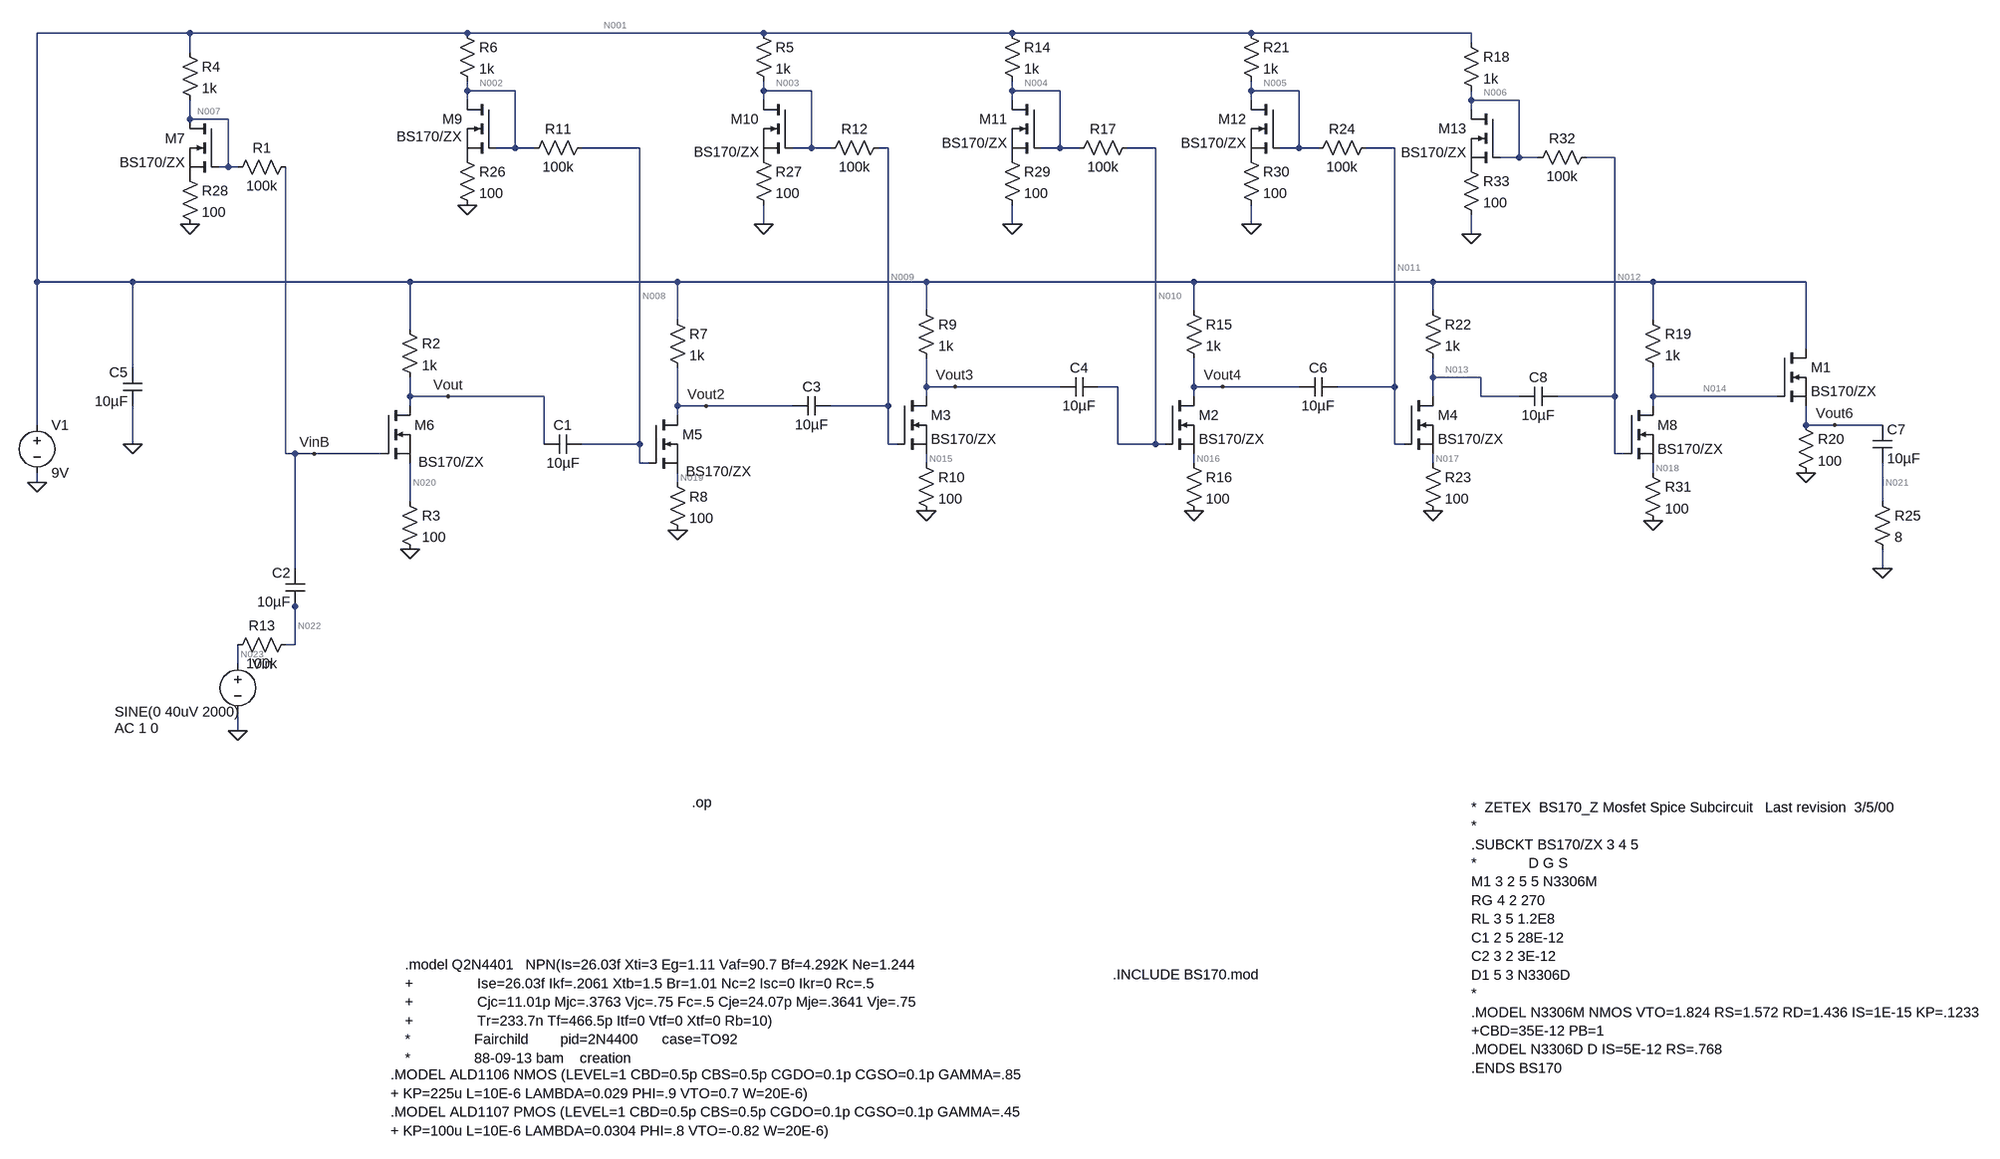
[diagram p0: schematic Design1v2.asc]
Design1v2.asc, the LTspice schematic file:
Version 4
SHEET 1 2836 1636
WIRE -144 -192 -400 -192
WIRE 320 -192 -144 -192
WIRE 816 -192 320 -192
WIRE 1232 -192 816 -192
WIRE 1632 -192 1232 -192
WIRE 2000 -192 1632 -192
WIRE 2000 -176 2000 -192
WIRE -144 -160 -144 -192
WIRE 320 -96 320 -112
WIRE 400 -96 320 -96
WIRE 816 -96 816 -112
WIRE 896 -96 816 -96
WIRE 1232 -96 1232 -112
WIRE 1312 -96 1232 -96
WIRE 1632 -96 1632 -112
WIRE 1712 -96 1632 -96
WIRE 320 -80 320 -96
WIRE 816 -80 816 -96
WIRE 1232 -80 1232 -96
WIRE 1632 -80 1632 -96
WIRE 2000 -80 2000 -96
WIRE 2080 -80 2000 -80
WIRE 2000 -64 2000 -80
WIRE -144 -48 -144 -80
WIRE -80 -48 -144 -48
WIRE 400 0 400 -96
WIRE 400 0 368 0
WIRE 432 0 400 0
WIRE 608 0 512 0
WIRE 896 0 896 -96
WIRE 896 0 864 0
WIRE 928 0 896 0
WIRE 1024 0 1008 0
WIRE 1312 0 1312 -96
WIRE 1312 0 1280 0
WIRE 1344 0 1312 0
WIRE 1472 0 1424 0
WIRE 1712 0 1712 -96
WIRE 1712 0 1680 0
WIRE 1744 0 1712 0
WIRE 1872 0 1824 0
WIRE 2080 16 2080 -80
WIRE 2080 16 2048 16
WIRE 2112 16 2080 16
WIRE 2240 16 2192 16
WIRE -80 32 -80 -48
WIRE -80 32 -96 32
WIRE -64 32 -80 32
WIRE 816 128 816 96
WIRE 1232 128 1232 96
WIRE 1632 128 1632 96
WIRE 2000 144 2000 112
WIRE -400 224 -400 -192
WIRE -240 224 -400 224
WIRE 224 224 -240 224
WIRE 672 224 224 224
WIRE 1088 224 672 224
WIRE 1536 224 1088 224
WIRE 1936 224 1536 224
WIRE 2304 224 1936 224
WIRE 2560 224 2304 224
WIRE 1088 272 1088 224
WIRE 1536 272 1536 224
WIRE 1936 272 1936 224
WIRE 672 288 672 224
WIRE 2304 288 2304 224
WIRE 224 304 224 224
WIRE 2560 336 2560 224
WIRE -240 368 -240 224
WIRE 1936 384 1936 352
WIRE 2016 384 1936 384
WIRE 1088 400 1088 352
WIRE 1136 400 1088 400
WIRE 1312 400 1136 400
WIRE 1408 400 1376 400
WIRE 1536 400 1536 352
WIRE 1584 400 1536 400
WIRE 1712 400 1584 400
WIRE 1872 400 1872 0
WIRE 1872 400 1776 400
WIRE 224 416 224 384
WIRE 288 416 224 416
WIRE 448 416 288 416
WIRE 1088 416 1088 400
WIRE 1536 416 1536 400
WIRE 1936 416 1936 384
WIRE 2016 416 2016 384
WIRE 2080 416 2016 416
WIRE 2240 416 2240 16
WIRE 2240 416 2144 416
WIRE 2304 416 2304 368
WIRE 2512 416 2304 416
WIRE 224 432 224 416
WIRE 672 432 672 368
WIRE 720 432 672 432
WIRE 864 432 720 432
WIRE 1024 432 1024 0
WIRE 1024 432 928 432
WIRE 2304 432 2304 416
WIRE 672 448 672 432
WIRE -400 464 -400 224
WIRE 2560 464 2560 432
WIRE 2608 464 2560 464
WIRE 2688 464 2608 464
WIRE -240 496 -240 432
WIRE 448 496 448 416
WIRE 608 496 608 0
WIRE 608 496 512 496
WIRE 1024 496 1024 432
WIRE 1040 496 1024 496
WIRE 1408 496 1408 400
WIRE 1472 496 1472 0
WIRE 1472 496 1408 496
WIRE 1488 496 1472 496
WIRE 1872 496 1872 400
WIRE 1888 496 1872 496
WIRE 16 512 16 32
WIRE 32 512 16 512
WIRE 64 512 32 512
WIRE 176 512 64 512
WIRE 2240 512 2240 416
WIRE 2256 512 2240 512
WIRE 608 528 608 496
WIRE 624 528 608 528
WIRE 1088 528 1088 512
WIRE 1536 528 1536 512
WIRE 1936 528 1936 512
WIRE 2304 544 2304 528
WIRE -400 560 -400 544
WIRE 672 560 672 544
WIRE 224 592 224 528
WIRE 2688 592 2688 528
WIRE 32 704 32 512
WIRE 2688 704 2688 672
WIRE 32 768 32 752
WIRE 32 832 32 768
WIRE 32 832 16 832
WIRE -64 864 -64 832
WIRE -64 976 -64 944
FLAG -400 560 0
FLAG 224 672 0
FLAG 320 96 0
FLAG 672 640 0
FLAG 288 416 Vout
FLAG -64 976 0
FLAG 64 512 VinB
FLAG 720 432 Vout2
FLAG 816 128 0
FLAG 1088 608 0
FLAG 1136 400 Vout3
FLAG 1232 128 0
FLAG 1536 608 0
FLAG 1584 400 Vout4
FLAG 2608 464 Vout6
FLAG 1632 128 0
FLAG 1936 608 0
FLAG 2560 544 0
FLAG -144 128 0
FLAG 2688 704 0
FLAG -240 496 0
FLAG 2000 144 0
FLAG 2304 624 0
SYMBOL cap 48 768 R180
WINDOW 0 24 56 Left 2
WINDOW 3 24 8 Left 2
SYMATTR InstName C2
SYMATTR Value 10µF
SYMBOL voltage -400 448 R0
SYMATTR InstName V1
SYMATTR Value 9V
SYMBOL voltage -64 848 R0
WINDOW 3 -206 96 Left 2
WINDOW 123 -206 124 Left 2
WINDOW 39 0 0 Left 2
SYMATTR Value SINE(0 40uV 2000)
SYMATTR Value2 AC 1 0
SYMATTR InstName Vin
SYMBOL res 208 576 R0
SYMATTR InstName R3
SYMATTR Value 100
SYMBOL res -160 -176 R0
SYMATTR InstName R4
SYMATTR Value 1k
SYMBOL res 208 288 R0
SYMATTR InstName R2
SYMATTR Value 1k
SYMBOL res 304 -208 R0
SYMATTR InstName R6
SYMATTR Value 1k
SYMBOL res 656 272 R0
SYMATTR InstName R7
SYMATTR Value 1k
SYMBOL res 656 544 R0
SYMATTR InstName R8
SYMATTR Value 100
SYMBOL res 528 -16 R90
WINDOW 0 0 56 VBottom 2
WINDOW 3 32 56 VTop 2
SYMATTR InstName R11
SYMATTR Value 100k
SYMBOL cap 512 480 R90
WINDOW 0 0 32 VBottom 2
WINDOW 3 32 32 VTop 2
SYMATTR InstName C1
SYMATTR Value 10µF
SYMBOL res 800 -208 R0
SYMATTR InstName R5
SYMATTR Value 1k
SYMBOL res 1072 256 R0
SYMATTR InstName R9
SYMATTR Value 1k
SYMBOL res 1072 512 R0
SYMATTR InstName R10
SYMATTR Value 100
SYMBOL res 1024 -16 R90
WINDOW 0 0 56 VBottom 2
WINDOW 3 32 56 VTop 2
SYMATTR InstName R12
SYMATTR Value 100k
SYMBOL cap 928 416 R90
WINDOW 0 0 32 VBottom 2
WINDOW 3 32 32 VTop 2
SYMATTR InstName C3
SYMATTR Value 10µF
SYMBOL res 1216 -208 R0
SYMATTR InstName R14
SYMATTR Value 1k
SYMBOL res 1520 256 R0
SYMATTR InstName R15
SYMATTR Value 1k
SYMBOL res 1520 512 R0
SYMATTR InstName R16
SYMATTR Value 100
SYMBOL res 1440 -16 R90
WINDOW 0 0 56 VBottom 2
WINDOW 3 32 56 VTop 2
SYMATTR InstName R17
SYMATTR Value 100k
SYMBOL cap 1376 384 R90
WINDOW 0 0 32 VBottom 2
WINDOW 3 32 32 VTop 2
SYMATTR InstName C4
SYMATTR Value 10µF
SYMBOL res 1616 -208 R0
SYMATTR InstName R21
SYMATTR Value 1k
SYMBOL res 1920 256 R0
SYMATTR InstName R22
SYMATTR Value 1k
SYMBOL res 1920 512 R0
SYMATTR InstName R23
SYMATTR Value 100
SYMBOL res 1840 -16 R90
WINDOW 0 0 56 VBottom 2
WINDOW 3 32 56 VTop 2
SYMATTR InstName R24
SYMATTR Value 100k
SYMBOL cap 1776 384 R90
WINDOW 0 0 32 VBottom 2
WINDOW 3 32 32 VTop 2
SYMATTR InstName C6
SYMATTR Value 10µF
SYMBOL res 2672 576 R0
SYMATTR InstName R25
SYMATTR Value 8
SYMBOL res 2544 448 R0
SYMATTR InstName R20
SYMATTR Value 100
SYMBOL cap 2672 464 R0
SYMATTR InstName C7
SYMATTR Value 10µF
SYMBOL nmos 1040 416 R0
SYMATTR InstName M3
SYMATTR Value BS170/ZX
SYMATTR Prefix X
SYMBOL nmos 2512 336 R0
SYMATTR InstName M1
SYMATTR Value BS170/ZX
SYMATTR Prefix X
SYMBOL nmos 1488 416 R0
SYMATTR InstName M2
SYMATTR Value BS170/ZX
SYMATTR Prefix X
SYMBOL nmos 1888 416 R0
SYMATTR InstName M4
SYMATTR Value BS170/ZX
SYMATTR Prefix X
SYMBOL nmos 176 432 R0
WINDOW 3 62 94 Left 2
SYMATTR Value BS170/ZX
SYMATTR InstName M6
SYMATTR Prefix X
SYMBOL nmos -96 -48 M0
SYMATTR InstName M7
SYMATTR Value BS170/ZX
SYMATTR Prefix X
SYMBOL nmos 368 -80 M0
WINDOW 3 57 61 Left 2
SYMATTR Value BS170/ZX
SYMATTR InstName M9
SYMATTR Prefix X
SYMBOL nmos 864 -80 M0
WINDOW 3 55 87 Left 2
SYMATTR Value BS170/ZX
SYMATTR InstName M10
SYMATTR Prefix X
SYMBOL nmos 1280 -80 M0
SYMATTR InstName M11
SYMATTR Value BS170/ZX
SYMATTR Prefix X
SYMBOL nmos 1680 -80 M0
SYMATTR InstName M12
SYMATTR Value BS170/ZX
SYMATTR Prefix X
SYMBOL nmos 624 448 R0
WINDOW 3 62 94 Left 2
SYMATTR Value BS170/ZX
SYMATTR InstName M5
SYMATTR Prefix X
SYMBOL res 32 816 R90
WINDOW 0 0 56 VBottom 2
WINDOW 3 32 56 VTop 2
SYMATTR InstName R13
SYMATTR Value 100k
SYMBOL res -160 32 R0
SYMATTR InstName R28
SYMATTR Value 100
SYMBOL res 304 0 R0
SYMATTR InstName R26
SYMATTR Value 100
SYMBOL res 800 0 R0
SYMATTR InstName R27
SYMATTR Value 100
SYMBOL res 1216 0 R0
SYMATTR InstName R29
SYMATTR Value 100
SYMBOL res 1616 0 R0
SYMATTR InstName R30
SYMATTR Value 100
SYMBOL cap -224 432 R180
WINDOW 0 24 56 Left 2
WINDOW 3 24 8 Left 2
SYMATTR InstName C5
SYMATTR Value 10µF
SYMBOL res 32 16 R90
WINDOW 0 0 56 VBottom 2
WINDOW 3 32 56 VTop 2
SYMATTR InstName R1
SYMATTR Value 100k
SYMBOL res 1984 -192 R0
SYMATTR InstName R18
SYMATTR Value 1k
SYMBOL res 2288 272 R0
SYMATTR InstName R19
SYMATTR Value 1k
SYMBOL res 2288 528 R0
SYMATTR InstName R31
SYMATTR Value 100
SYMBOL res 2208 0 R90
WINDOW 0 0 56 VBottom 2
WINDOW 3 32 56 VTop 2
SYMATTR InstName R32
SYMATTR Value 100k
SYMBOL cap 2144 400 R90
WINDOW 0 0 32 VBottom 2
WINDOW 3 32 32 VTop 2
SYMATTR InstName C8
SYMATTR Value 10µF
SYMBOL nmos 2256 432 R0
SYMATTR InstName M8
SYMATTR Value BS170/ZX
SYMATTR Prefix X
SYMBOL nmos 2048 -64 M0
SYMATTR InstName M13
SYMATTR Value BS170/ZX
SYMATTR Prefix X
SYMBOL res 1984 16 R0
SYMATTR InstName R33
SYMATTR Value 100
TEXT 192 1552 Left 2 !.MODEL ALD1106 NMOS (LEVEL=1 CBD=0.5p CBS=0.5p CGDO=0.1p CGSO=0.1p GAMMA=.85\n+ KP=225u L=10E-6 LAMBDA=0.029 PHI=.9 VTO=0.7 W=20E-6)\n.MODEL ALD1107 PMOS (LEVEL=1 CBD=0.5p CBS=0.5p CGDO=0.1p CGSO=0.1p GAMMA=.45\n+ KP=100u L=10E-6 LAMBDA=0.0304 PHI=.8 VTO=-0.82 W=20E-6)
TEXT 1400 1384 Left 2 !.INCLUDE BS170.mod
TEXT 2000 1104 Left 2 !*  ZETEX  BS170_Z Mosfet Spice Subcircuit   Last revision  3/5/00\n*\n.SUBCKT BS170/ZX 3 4 5\n*             D G S\nM1 3 2 5 5 N3306M\nRG 4 2 270\nRL 3 5 1.2E8\nC1 2 5 28E-12\nC2 3 2 3E-12 \nD1 5 3 N3306D\n*\n.MODEL N3306M NMOS VTO=1.824 RS=1.572 RD=1.436 IS=1E-15 KP=.1233\n+CBD=35E-12 PB=1\n.MODEL N3306D D IS=5E-12 RS=.768\n.ENDS BS170
TEXT 216 1368 Left 2 !.model Q2N4401   NPN(Is=26.03f Xti=3 Eg=1.11 Vaf=90.7 Bf=4.292K Ne=1.244\n+                Ise=26.03f Ikf=.2061 Xtb=1.5 Br=1.01 Nc=2 Isc=0 Ikr=0 Rc=.5\n+                Cjc=11.01p Mjc=.3763 Vjc=.75 Fc=.5 Cje=24.07p Mje=.3641 Vje=.75\n+                Tr=233.7n Tf=466.5p Itf=0 Vtf=0 Xtf=0 Rb=10)\n*                Fairchild        pid=2N4400      case=TO92\n*                88-09-13 bam    creation
TEXT 696 1096 Left 2 !.op

The netlist it stands for:
* Design1v2.asc
C2 N022 VinB 10µF
V1 N001 0 9V
Vin N023 0 SINE(0 40uV 2000) AC 1 0
R3 N020 0 100
R4 N001 N007 1k
R2 N001 Vout 1k
R6 N001 N002 1k
R7 N001 Vout2 1k
R8 N019 0 100
R11 N008 N002 100k
C1 N008 Vout 10µF
R5 N001 N003 1k
R9 N001 Vout3 1k
R10 N015 0 100
R12 N009 N003 100k
C3 N009 Vout2 10µF
R14 N001 N004 1k
R15 N001 Vout4 1k
R16 N016 0 100
R17 N010 N004 100k
C4 N010 Vout3 10µF
R21 N001 N005 1k
R22 N001 N013 1k
R23 N017 0 100
R24 N011 N005 100k
C6 N011 Vout4 10µF
R25 N021 0 8
R20 Vout6 0 100
C7 Vout6 N021 10µF
XM3 Vout3 N009 N015 BS170/ZX  ; pins D G S
XM1 N001 N014 Vout6 BS170/ZX  ; pins D G S
XM2 Vout4 N010 N016 BS170/ZX  ; pins D G S
XM4 N013 N011 N017 BS170/ZX  ; pins D G S
XM6 Vout VinB N020 BS170/ZX  ; pins D G S
XM7 N007 N007 P001 BS170/ZX  ; pins D G S
XM9 N002 N002 P002 BS170/ZX  ; pins D G S
XM10 N003 N003 P003 BS170/ZX  ; pins D G S
XM11 N004 N004 P004 BS170/ZX  ; pins D G S
XM12 N005 N005 P005 BS170/ZX  ; pins D G S
XM5 Vout2 N008 N019 BS170/ZX  ; pins D G S
R13 N022 N023 100k
R28 P001 0 100
R26 P002 0 100
R27 P003 0 100
R29 P004 0 100
R30 P005 0 100
C5 0 N001 10µF
R1 VinB N007 100k
R18 N001 N006 1k
R19 N001 N014 1k
R31 N018 0 100
R32 N012 N006 100k
C8 N012 N013 10µF
XM8 N014 N012 N018 BS170/ZX  ; pins D G S
XM13 N006 N006 P006 BS170/ZX  ; pins D G S
R33 P006 0 100
.MODEL ALD1106 NMOS (LEVEL=1 CBD=0.5p CBS=0.5p CGDO=0.1p CGSO=0.1p GAMMA=.85
+ KP=225u L=10E-6 LAMBDA=0.029 PHI=.9 VTO=0.7 W=20E-6)
.MODEL ALD1107 PMOS (LEVEL=1 CBD=0.5p CBS=0.5p CGDO=0.1p CGSO=0.1p GAMMA=.45
+ KP=100u L=10E-6 LAMBDA=0.0304 PHI=.8 VTO=-0.82 W=20E-6)
.INCLUDE BS170.mod
*  ZETEX  BS170_Z Mosfet Spice Subcircuit   Last revision  3/5/00
*
.SUBCKT BS170/ZX 3 4 5
*             D G S
M1 3 2 5 5 N3306M
RG 4 2 270
RL 3 5 1.2E8
C1 2 5 28E-12
C2 3 2 3E-12
D1 5 3 N3306D
*
.MODEL N3306M NMOS VTO=1.824 RS=1.572 RD=1.436 IS=1E-15 KP=.1233
+CBD=35E-12 PB=1
.MODEL N3306D D IS=5E-12 RS=.768
.ENDS BS170
.model Q2N4401   NPN(Is=26.03f Xti=3 Eg=1.11 Vaf=90.7 Bf=4.292K Ne=1.244
+                Ise=26.03f Ikf=.2061 Xtb=1.5 Br=1.01 Nc=2 Isc=0 Ikr=0 Rc=.5
+                Cjc=11.01p Mjc=.3763 Vjc=.75 Fc=.5 Cje=24.07p Mje=.3641 Vje=.75
+                Tr=233.7n Tf=466.5p Itf=0 Vtf=0 Xtf=0 Rb=10)
*                Fairchild        pid=2N4400      case=TO92
*                88-09-13 bam    creation
.op
.backanno
.end

* Results of the author's LTspice run, read from the files saved beside the schematic
* Operating Point, zero values left out:
*   V(vinb) = 2.774 V
*   V(n001) = 9 V
*   V(n020) = 622.6 mV
*   V(n007) = 2.774 V
*   V(vout) = 2.774 V
*   V(n002) = 2.774 V
*   V(vout2) = 2.774 V
*   V(n019) = 622.6 mV
*   V(n008) = 2.774 V
*   V(n003) = 2.774 V
*   V(vout3) = 2.774 V
*   V(n015) = 622.6 mV
*   V(n009) = 2.774 V
*   V(n004) = 2.774 V
*   V(vout4) = 2.774 V
*   V(n016) = 622.6 mV
*   V(n010) = 2.774 V
*   V(n005) = 2.774 V
*   V(n013) = 2.774 V
*   V(n017) = 622.6 mV
*   V(n011) = 2.774 V
*   V(vout6) = 622.6 mV
*   V(n014) = 2.774 V
*   V(p001) = 622.6 mV
*   V(p002) = 622.6 mV
*   V(p003) = 622.6 mV
*   V(p004) = 622.6 mV
*   V(p005) = 622.6 mV
*   V(n006) = 2.774 V
*   V(n018) = 622.6 mV
*   V(n012) = 2.774 V
*   V(p006) = 622.6 mV
*   I(R33) = 6.226 mA
*   I(R31) = 6.226 mA
*   I(R19) = 6.226 mA
*   I(R18) = 6.226 mA
*   I(R30) = 6.226 mA
*   I(R29) = 6.226 mA
*   I(R27) = 6.226 mA
*   I(R26) = 6.226 mA
*   I(R28) = 6.226 mA
*   I(R20) = 6.226 mA
*   I(R23) = 6.226 mA
*   I(R22) = 6.226 mA
*   I(R21) = 6.226 mA
*   I(R16) = 6.226 mA
*   I(R15) = 6.226 mA
*   I(R14) = 6.226 mA
*   I(R10) = 6.226 mA
*   I(R9) = 6.226 mA
*   I(R5) = 6.226 mA
*   I(R8) = 6.226 mA
*   I(R7) = 6.226 mA
*   I(R6) = 6.226 mA
*   I(R2) = 6.226 mA
*   I(R4) = 6.226 mA
*   I(R3) = 6.226 mA
*   I(V1) = -80.94 mA
* Operating Point:
*   V(n022) = 2.774 pV
*   V(vinb) = 2.774 V
*   V(n001) = 9 V
*   V(n023) = 0 V
*   V(n020) = 622.6 mV
*   V(n007) = 2.774 V
*   V(vout) = 2.774 V
*   V(n002) = 2.774 V
*   V(vout2) = 2.774 V
*   V(n019) = 622.6 mV
*   V(n008) = 2.774 V
*   V(n003) = 2.774 V
*   V(vout3) = 2.774 V
*   V(n015) = 622.6 mV
*   V(n009) = 2.774 V
*   V(n004) = 2.774 V
*   V(vout4) = 2.774 V
*   V(n016) = 622.6 mV
*   V(n010) = 2.774 V
*   V(n005) = 2.774 V
*   V(n013) = 2.774 V
*   V(n017) = 622.6 mV
*   V(n011) = 2.774 V
*   V(n021) = 0 V
*   V(vout6) = 622.6 mV
*   V(n014) = 2.774 V
*   V(p001) = 622.6 mV
*   V(p002) = 622.6 mV
*   V(p003) = 622.6 mV
*   V(p004) = 622.6 mV
*   V(p005) = 622.6 mV
*   V(n006) = 2.774 V
*   V(n018) = 622.6 mV
*   V(n012) = 2.774 V
*   V(p006) = 622.6 mV
*   I(C8) = 0 A
*   I(C5) = 0 A
*   I(C7) = 0 A
*   I(C6) = 0 A
*   I(C4) = 0 A
*   I(C3) = 0 A
*   I(C1) = 0 A
*   I(C2) = 0 A
*   I(R33) = 6.226 mA
*   I(R32) = 0 A
*   I(R31) = 6.226 mA
*   I(R19) = 6.226 mA
*   I(R18) = 6.226 mA
*   I(R1) = 0 A
*   I(R30) = 6.226 mA
*   I(R29) = 6.226 mA
*   I(R27) = 6.226 mA
*   I(R26) = 6.226 mA
*   I(R28) = 6.226 mA
*   I(R13) = 0 A
*   I(R20) = 6.226 mA
*   I(R25) = 0 A
*   I(R24) = 0 A
*   I(R23) = 6.226 mA
*   I(R22) = 6.226 mA
*   I(R21) = 6.226 mA
*   I(R17) = 0 A
*   I(R16) = 6.226 mA
*   I(R15) = 6.226 mA
*   I(R14) = 6.226 mA
*   I(R12) = 0 A
*   I(R10) = 6.226 mA
*   I(R9) = 6.226 mA
*   I(R5) = 6.226 mA
*   I(R11) = 0 A
*   I(R8) = 6.226 mA
*   I(R7) = 6.226 mA
*   I(R6) = 6.226 mA
*   I(R2) = 6.226 mA
*   I(R4) = 6.226 mA
*   I(R3) = 6.226 mA
*   I(Vin) = 0 A
*   I(V1) = -80.94 mA
* From the log:
*   Semiconductor Device Operating Points:
*                           --- Diodes ---
*   Name:    d:m13:1     d:m8:1      d:m5:1      d:m12:1     d:m11:1
*   Model: m13:n3306d   m8:n3306d   m5:n3306d  m12:n3306d  m11:n3306d
*   Id:     -7.15e-12   -7.15e-12   -7.15e-12   -7.15e-12   -7.15e-12
*   Vd:     -2.15e+00   -2.15e+00   -2.15e+00   -2.15e+00   -2.15e+00
*   Req:     1.00e+12    1.00e+12    1.00e+12    1.00e+12    1.00e+12
*   CAP:     0.00e+00    0.00e+00    0.00e+00    0.00e+00    0.00e+00
*   Name:    d:m10:1     d:m9:1      d:m7:1      d:m6:1      d:m4:1
*   Model: m10:n3306d   m9:n3306d   m7:n3306d   m6:n3306d   m4:n3306d
*   Id:     -7.15e-12   -7.15e-12   -7.15e-12   -7.15e-12   -7.15e-12
*   Vd:     -2.15e+00   -2.15e+00   -2.15e+00   -2.15e+00   -2.15e+00
*   Req:     1.00e+12    1.00e+12    1.00e+12    1.00e+12    1.00e+12
*   CAP:     0.00e+00    0.00e+00    0.00e+00    0.00e+00    0.00e+00
*   Name:    d:m2:1      d:m1:1      d:m3:1
*   Model:  m2:n3306d   m1:n3306d   m3:n3306d
*   Id:     -7.15e-12   -1.34e-11   -7.15e-12
*   Vd:     -2.15e+00   -8.38e+00   -2.15e+00
*   Req:     1.00e+12    1.00e+12    1.00e+12
*   CAP:     0.00e+00    0.00e+00    0.00e+00
*                           --- MOSFET Transistors ---
*   Name:        m:m13:1     m:m8:1      m:m5:1      m:m12:1     m:m11:1
*   Model:     m13:n3306m   m8:n3306m   m5:n3306m  m12:n3306m  m11:n3306m
*   Id:          6.23e-03    6.23e-03    6.23e-03    6.23e-03    6.23e-03
*   Vgs:         2.15e+00    2.15e+00    2.15e+00    2.15e+00    2.15e+00
*   Vds:         2.15e+00    2.15e+00    2.15e+00    2.15e+00    2.15e+00
*   Vbs:         0.00e+00    0.00e+00    0.00e+00    0.00e+00    0.00e+00
*   Vth:         1.82e+00    1.82e+00    1.82e+00    1.82e+00    1.82e+00
*   Vdsat:       3.18e-01    3.18e-01    3.18e-01    3.18e-01    3.18e-01
*   Gm:          3.92e-02    3.92e-02    3.92e-02    3.92e-02    3.92e-02
*   Gds:         0.00e+00    0.00e+00    0.00e+00    0.00e+00    0.00e+00
*   Gmb:         0.00e+00    0.00e+00    0.00e+00    0.00e+00    0.00e+00
*   Cbd:         1.97e-11    1.97e-11    1.97e-11    1.97e-11    1.97e-11
*   Cbs:         0.00e+00    0.00e+00    0.00e+00    0.00e+00    0.00e+00
*   Cgsov:       0.00e+00    0.00e+00    0.00e+00    0.00e+00    0.00e+00
*   Cgdov:       0.00e+00    0.00e+00    0.00e+00    0.00e+00    0.00e+00
*   Cgbov:       0.00e+00    0.00e+00    0.00e+00    0.00e+00    0.00e+00
*   Cgs:         0.00e+00    0.00e+00    0.00e+00    0.00e+00    0.00e+00
*   Cgd:         0.00e+00    0.00e+00    0.00e+00    0.00e+00    0.00e+00
*   Cgb:         0.00e+00    0.00e+00    0.00e+00    0.00e+00    0.00e+00
*   Name:        m:m10:1     m:m9:1      m:m7:1      m:m6:1      m:m4:1
*   Model:     m10:n3306m   m9:n3306m   m7:n3306m   m6:n3306m   m4:n3306m
*   Id:          6.23e-03    6.23e-03    6.23e-03    6.23e-03    6.23e-03
*   Vgs:         2.15e+00    2.15e+00    2.15e+00    2.15e+00    2.15e+00
*   Vds:         2.15e+00    2.15e+00    2.15e+00    2.15e+00    2.15e+00
*   Vbs:         0.00e+00    0.00e+00    0.00e+00    0.00e+00    0.00e+00
*   Vth:         1.82e+00    1.82e+00    1.82e+00    1.82e+00    1.82e+00
*   Vdsat:       3.18e-01    3.18e-01    3.18e-01    3.18e-01    3.18e-01
*   Gm:          3.92e-02    3.92e-02    3.92e-02    3.92e-02    3.92e-02
*   Gds:         0.00e+00    0.00e+00    0.00e+00    0.00e+00    0.00e+00
*   Gmb:         0.00e+00    0.00e+00    0.00e+00    0.00e+00    0.00e+00
*   Cbd:         1.97e-11    1.97e-11    1.97e-11    1.97e-11    1.97e-11
*   Cbs:         0.00e+00    0.00e+00    0.00e+00    0.00e+00    0.00e+00
*   Cgsov:       0.00e+00    0.00e+00    0.00e+00    0.00e+00    0.00e+00
*   Cgdov:       0.00e+00    0.00e+00    0.00e+00    0.00e+00    0.00e+00
*   Cgbov:       0.00e+00    0.00e+00    0.00e+00    0.00e+00    0.00e+00
*   Cgs:         0.00e+00    0.00e+00    0.00e+00    0.00e+00    0.00e+00
*   Cgd:         0.00e+00    0.00e+00    0.00e+00    0.00e+00    0.00e+00
*   Cgb:         0.00e+00    0.00e+00    0.00e+00    0.00e+00    0.00e+00
*   Name:        m:m2:1      m:m1:1      m:m3:1
*   Model:      m2:n3306m   m1:n3306m   m3:n3306m
*   Id:          6.23e-03    6.23e-03    6.23e-03
*   Vgs:         2.15e+00    2.15e+00    2.15e+00
*   Vds:         2.15e+00    8.38e+00    2.15e+00
*   Vbs:         0.00e+00    0.00e+00    0.00e+00
*   Vth:         1.82e+00    1.82e+00    1.82e+00
*   Vdsat:       3.18e-01    3.18e-01    3.18e-01
*   Gm:          3.92e-02    3.92e-02    3.92e-02
*   Gds:         0.00e+00    0.00e+00    0.00e+00
*   Gmb:         0.00e+00    0.00e+00    0.00e+00
*   Cbd:         1.97e-11    1.14e-11    1.97e-11
*   Cbs:         0.00e+00    0.00e+00    0.00e+00
*   Cgsov:       0.00e+00    0.00e+00    0.00e+00
*   Cgdov:       0.00e+00    0.00e+00    0.00e+00
*   Cgbov:       0.00e+00    0.00e+00    0.00e+00
*   Cgs:         0.00e+00    0.00e+00    0.00e+00
*   Cgd:         0.00e+00    0.00e+00    0.00e+00
*   Cgb:         0.00e+00    0.00e+00    0.00e+00
*   Operating Bias Point Solution:
*           V(n022)                  0   voltage
*           V(vinb)                  0   voltage
*           V(n001)                  0   voltage
*           V(n023)                  0   voltage
*           V(n020)                  0   voltage
*           V(n007)                  0   voltage
*           V(vout)                  0   voltage
*           V(n002)                  0   voltage
*          V(vout2)                  0   voltage
*           V(n019)                  0   voltage
*           V(n008)                  0   voltage
*           V(n003)                  0   voltage
*          V(vout3)                  0   voltage
*           V(n015)                  0   voltage
*           V(n009)                  0   voltage
*           V(n004)                  0   voltage
*          V(vout4)                  0   voltage
*           V(n016)                  0   voltage
*           V(n010)                  0   voltage
*           V(n005)                  0   voltage
*           V(n013)                  0   voltage
*           V(n017)                  0   voltage
*           V(n011)                  0   voltage
*           V(n021)                  0   voltage
*          V(vout6)                  0   voltage
*           V(n014)                  0   voltage
*           V(p001)                  0   voltage
*           V(p002)                  0   voltage
*           V(p003)                  0   voltage
*           V(p004)                  0   voltage
*           V(p005)                  0   voltage
*           V(n006)                  0   voltage
*           V(n018)                  0   voltage
*           V(n012)                  0   voltage
*           V(p006)                  0   voltage
*             I(C8)        8.21565e-31   device_current
*             I(C5)             -9e-17   device_current
*             I(C7)        6.22585e-18   device_current
*             I(C6)        9.16156e-30   device_current
*             I(C4)        1.02274e-29   device_current
*             I(C3)        9.62341e-30   device_current
*             I(C1)       -2.07443e-28   device_current
*             I(C2)       -2.77416e-17   device_current
*            I(R33)         0.00622584   device_current
*            I(R32)        1.55431e-18   device_current
*            I(R31)         0.00622584   device_current
*            I(R19)         0.00622584   device_current
*            I(R18)         0.00622584   device_current
*             I(R1)       -2.59037e-17   device_current
*            I(R30)         0.00622584   device_current
*            I(R29)         0.00622584   device_current
*            I(R27)         0.00622584   device_current
*            I(R26)         0.00622584   device_current
*            I(R28)         0.00622584   device_current
*            I(R13)        2.77416e-17   device_current
*            I(R20)         0.00622585   device_current
*            I(R25)        6.22585e-18   device_current
*            I(R24)                  0   device_current
*            I(R23)         0.00622584   device_current
*            I(R22)         0.00622584   device_current
*            I(R21)         0.00622584   device_current
*            I(R17)        1.55431e-18   device_current
*            I(R16)         0.00622584   device_current
*            I(R15)         0.00622584   device_current
*            I(R14)         0.00622584   device_current
*            I(R12)        1.55431e-18   device_current
*            I(R10)         0.00622584   device_current
*             I(R9)         0.00622584   device_current
*             I(R5)         0.00622584   device_current
*            I(R11)        1.55431e-18   device_current
*             I(R8)         0.00622584   device_current
*             I(R7)         0.00622584   device_current
*             I(R6)         0.00622584   device_current
*             I(R2)         0.00622584   device_current
*             I(R4)         0.00622584   device_current
*             I(R3)         0.00622584   device_current
*            I(Vin)        2.77416e-17   device_current
*             I(V1)          -0.080936   device_current
*          Ix(m3:3)         0.00622584   subckt_current
*          Ix(m3:4)                  0   subckt_current
*          Ix(m3:5)        -0.00622584   subckt_current
*          Ix(m1:3)         0.00622585   subckt_current
*          Ix(m1:4)       -3.28955e-18   subckt_current
*          Ix(m1:5)        -0.00622585   subckt_current
*          Ix(m2:3)         0.00622584   subckt_current
*          Ix(m2:4)                  0   subckt_current
*          Ix(m2:5)        -0.00622584   subckt_current
*          Ix(m4:3)         0.00622584   subckt_current
*          Ix(m4:4)                  0   subckt_current
*          Ix(m4:5)        -0.00622584   subckt_current
*          Ix(m6:3)         0.00622584   subckt_current
*          Ix(m6:4)                  0   subckt_current
*          Ix(m6:5)        -0.00622584   subckt_current
*          Ix(m7:3)         0.00622584   subckt_current
*          Ix(m7:4)                  0   subckt_current
*          Ix(m7:5)        -0.00622584   subckt_current
*          Ix(m9:3)         0.00622584   subckt_current
*          Ix(m9:4)                  0   subckt_current
*          Ix(m9:5)        -0.00622584   subckt_current
*         Ix(m10:3)         0.00622584   subckt_current
*         Ix(m10:4)                  0   subckt_current
*         Ix(m10:5)        -0.00622584   subckt_current
*         Ix(m11:3)         0.00622584   subckt_current
*         Ix(m11:4)                  0   subckt_current
*         Ix(m11:5)        -0.00622584   subckt_current
*         Ix(m12:3)         0.00622584   subckt_current
*         Ix(m12:4)        3.28955e-18   subckt_current
*         Ix(m12:5)        -0.00622584   subckt_current
*          Ix(m5:3)         0.00622584   subckt_current
*          Ix(m5:4)                  0   subckt_current
*          Ix(m5:5)        -0.00622584   subckt_current
*          Ix(m8:3)         0.00622584   subckt_current
*          Ix(m8:4)                  0   subckt_current
*          Ix(m8:5)        -0.00622584   subckt_current
*         Ix(m13:3)         0.00622584   subckt_current
*         Ix(m13:4)                  0   subckt_current
*         Ix(m13:5)        -0.00622584   subckt_current